# Altium schematic sheet CPU.SchDoc
size A3; SheetNumber: 2; SheetTotal: 7
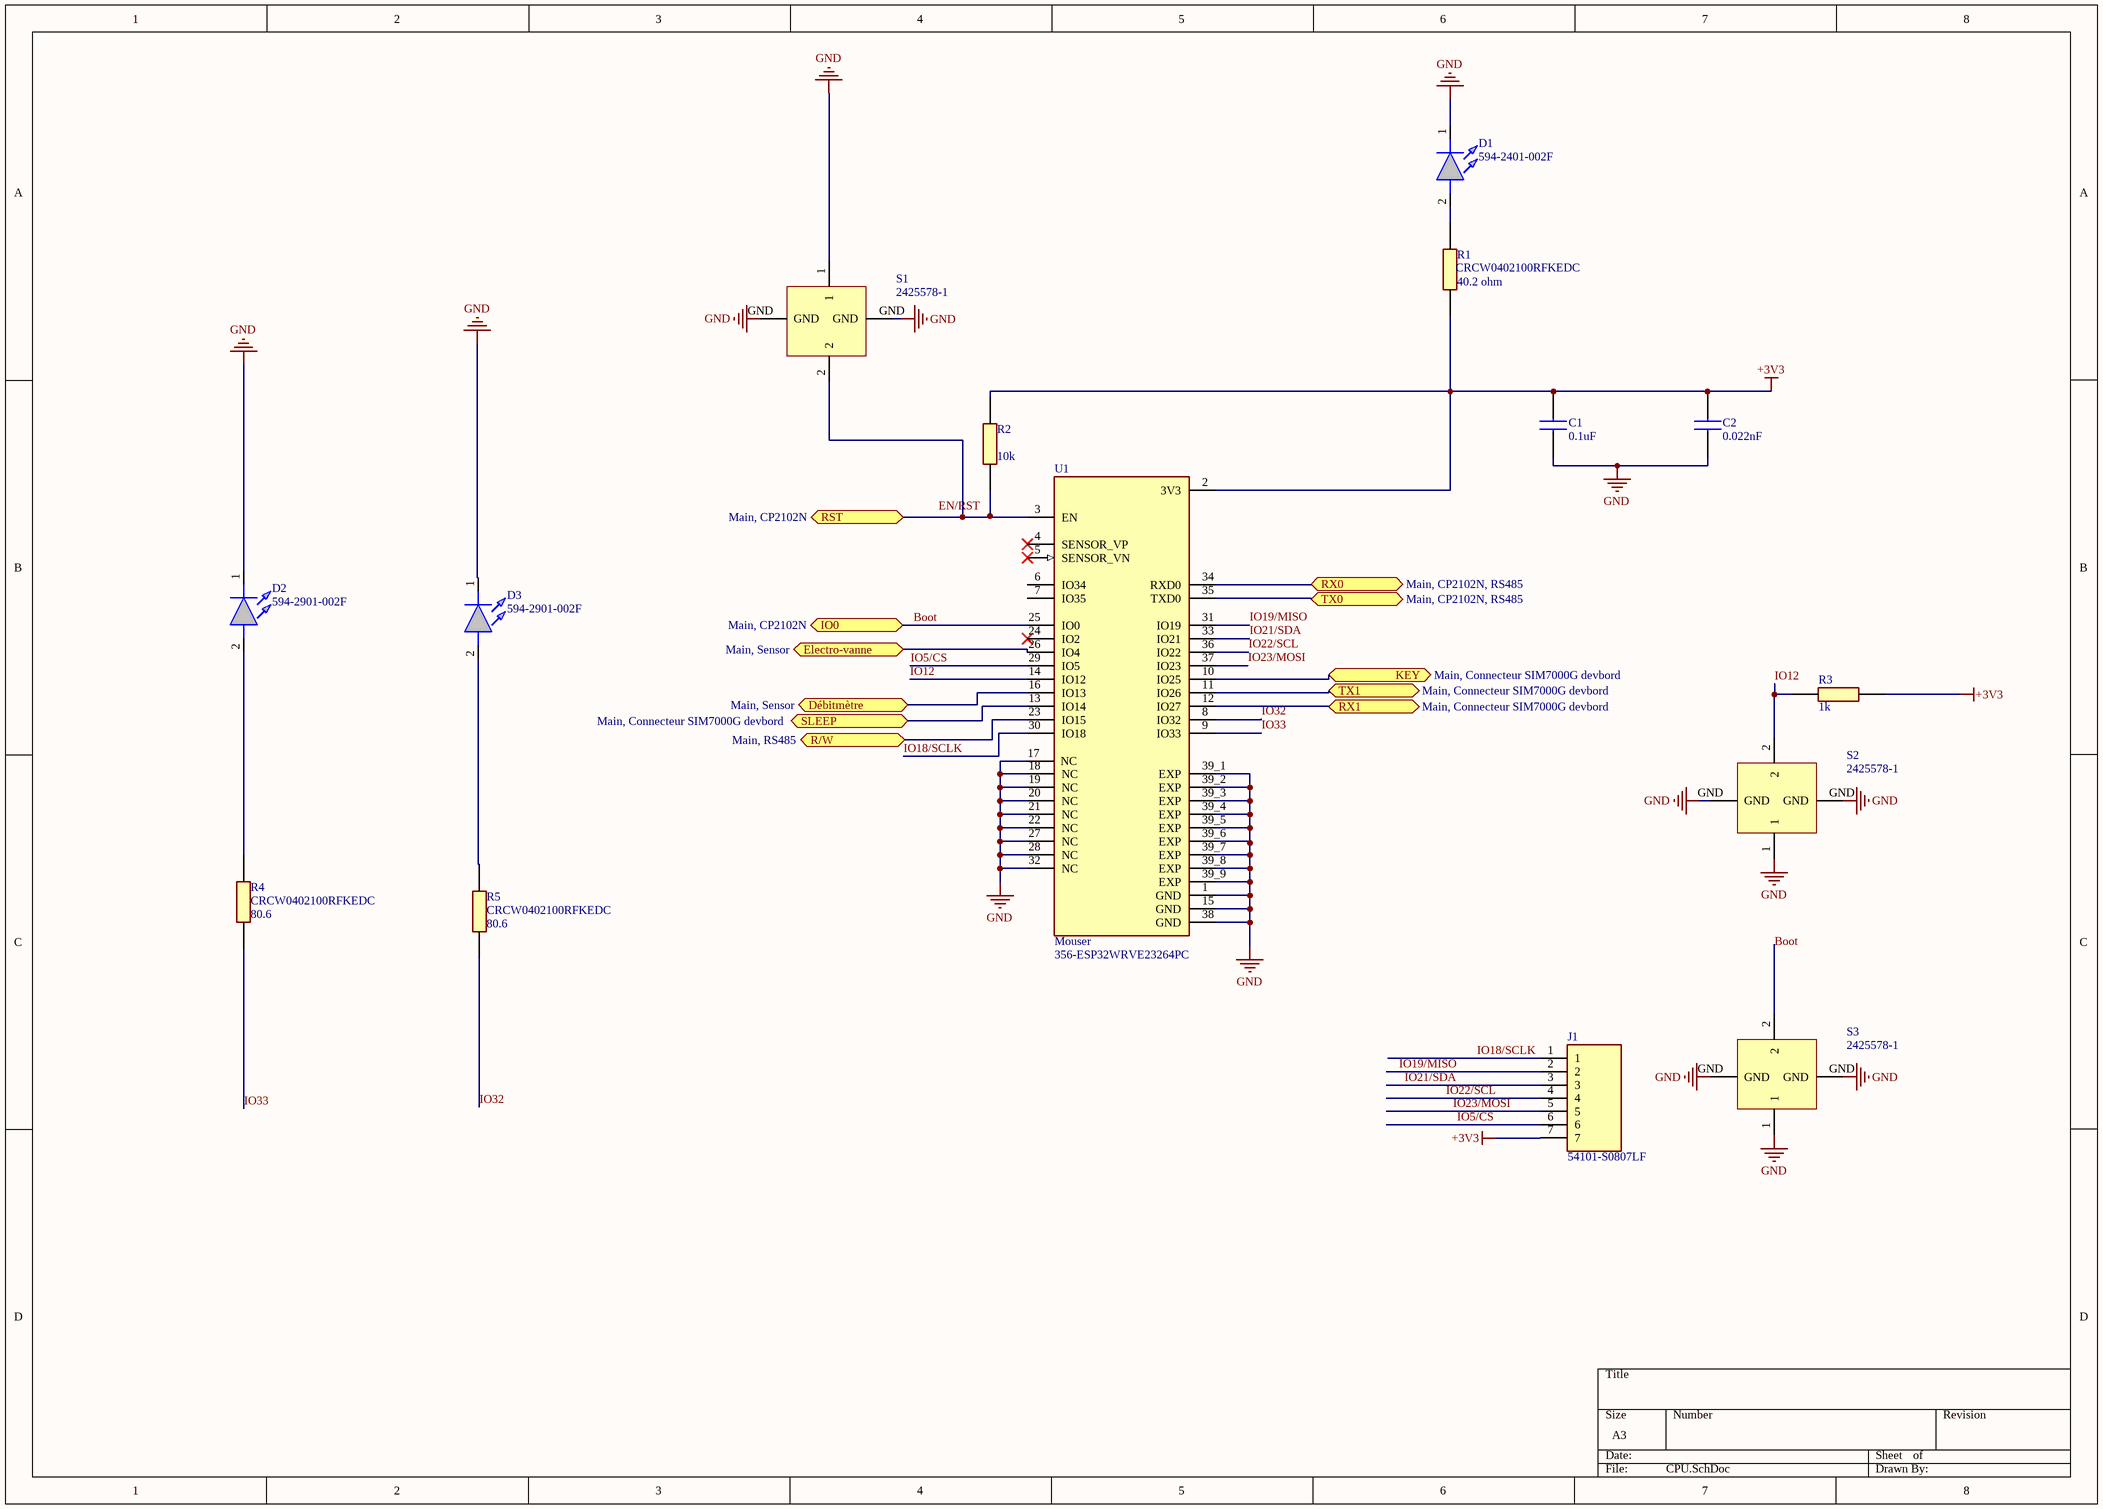
[diagram p0: CPU.SchDoc]

## Parts
C1  value 0.1uF  [CAPC1005X40N]  (hidden comment: 0402YD104KAT2A)
C2  value 0.022nF  [CAPC1005X40N]  (hidden comment: 0402ZD223KAT2A)
D1  594-2401-002F  [5942604013F]
D2  594-2901-002F  [5942604013F]
D3  594-2901-002F  [5942604013F]
J1  54101-S0807LF  [54101S0807LF]
R1  CRCW0402100RFKEDC  value 40.2 ohm  [RESC1005X40N]
R2  value 10k  [RESC1005X40N]  (hidden comment: RC0402FR-0710KL)
R3  value 1k  [RESC1005X40N]  (hidden comment: RT0402BRE071KL)
R4  CRCW0402100RFKEDC  value 80.6  [RESC1005X40N]
R5  CRCW0402100RFKEDC  value 80.6  [RESC1005X40N]
S1  2425578-1  [2425578-1]
S2  2425578-1  [2425578-1]
S3  2425578-1  [2425578-1]
U1  Supplier 1: Mouser  Supplier Part Number 1: 356-ESP32WRVE23264PC  [XCVR_ESP32-WROVER-E-N4R8]  (hidden comment: ESP32-WROVER-IE-N16R8)

## Ports
Débitmètre (bidir, see Main, Sensor), Electro-vanne (bidir, see Main, Sensor), IO0 (bidir, see Main, CP2102N), KEY (bidir, see Main, Connecteur SIM7000G devbord), R/W (bidir, see Main, RS485), RST (bidir, see Main, CP2102N), RX0 (bidir, see Main, CP2102N, RS485), RX1 (bidir, see Main, Connecteur SIM7000G devbord), SLEEP (bidir, see Main, Connecteur SIM7000G devbord), TX0 (bidir, see Main, CP2102N, RS485), TX1 (bidir, see Main, Connecteur SIM7000G devbord)

## Nets
+3V3: C1.2 C2.2 J1.7 R1.1 R2.2 R3.1 U1.2(3V3)
GND: C1.1 C2.1 D1.1(K) D2.1(K) D3.1(K) S1.1 S1.GND S2.1 S2.GND S3.1 S3.GND U1.1(GND) U1.15(GND) U1.17(NC) U1.18(NC) U1.19(NC) U1.20(NC) U1.21(NC) U1.22(NC) U1.27(NC) U1.28(NC) U1.32(NC) U1.38(GND) U1.39_1(EXP) U1.39_2(EXP) U1.39_3(EXP) U1.39_4(EXP) U1.39_5(EXP) U1.39_6(EXP) U1.39_7(EXP) U1.39_8(EXP) U1.39_9(EXP)
Boot: S3.2 U1.25(IO0) ; port IO0
Débitmètre: U1.16(IO13) ; port Débitmètre
Electro-vanne: U1.26(IO4) ; port Electro-vanne
IO5/CS: J1.6 U1.29(IO5)
IO12: R3.2 S2.2 U1.14(IO12)
IO18/SCLK: J1.1 U1.30(IO18)
IO19/MISO: J1.2 U1.31(IO19)
IO21/SDA: J1.3 U1.33(IO21)
IO22/SCL: J1.4 U1.36(IO22)
IO23/MOSI: J1.5 U1.37(IO23)
IO32: R5.1 U1.8(IO32)
IO33: R4.1 U1.9(IO33)
KEY: U1.10(IO25) ; port KEY
R/W: U1.23(IO15) ; port R/W
RST: R2.1 S1.2 U1.3(EN) ; port RST
RX0: U1.34(RXD0) ; port RX0
RX1: U1.12(IO27) ; port RX1
SLEEP: U1.13(IO14) ; port SLEEP
TX0: U1.35(TXD0) ; port TX0
TX1: U1.11(IO26) ; port TX1
NetD1_2: D1.2(A) R1.2
NetD2_2: D2.2(A) R4.2
NetD3_2: D3.2(A) R5.2

Not connected (* = marked no-connect by the designer): U1 4(SENSOR_VP)* 5(SENSOR_VN)* 6(IO34) 7(IO35) 24(IO2)*

## Notes on the sheet
- Labels drawn without touching a wire or pin: EN/RST

## Library data of the parts
C1 = 0402YD104KAT2A: Capacitor MLCC 0402 100nF 16V AVX 0402 Standard 100nF Ceramic Multilayer Capacitor, 16 V dc, +85C, X5R Dielectric, +/-10% SMD; Geometry.Height: 0.56mm; Mouser Part Number: 581-0402YD104K; Mouser Price/Stock: https://www.mouser.co.uk/ProductDetail/AVX/0402YD104KAT2A?qs=fS3i9m8Z%2FmrV7G1UZb6Y7g%3D%3D; Manufacturer_Name: AVX; Manufacturer_Part_Number: 0402YD104KAT2A; Datasheet Link: *; Supplier Part Number 1: 0402YD104KAT2A; Supplier 1: Avnet
C2 = 0402ZD223KAT2A: Multilayer Ceramic Capacitors MLCC - SMD/SMT 10V 0.022uF X5R 0402 10%; Manufacturer_Name: AVX; Manufacturer_Part_Number: 0402YD104KAT2A; Geometry.Height: 0.56mm; Mouser Part Number: 581-0402ZD223KAT2A; Mouser Price/Stock: https://www.mouser.co.uk/ProductDetail/AVX/0402YD104KAT2A?qs=fS3i9m8Z%2FmrV7G1UZb6Y7g%3D%3D; Datasheet Link: *; Supplier Part Number 1: 0402YD104KAT2A; Supplier 1: Avnet
D1-D3 = 594-2604-013F: LED Circuit Board Indicators 1.6mm IceBlue 2mA 13in reel; Manufacturer_Name: Dialight; Geometry.Height: 4.49mm; Mouser Part Number: 645-594-2604-013F; Mouser Price/Stock: https://www.mouser.co.uk/ProductDetail/Dialight/594-2604-013F?qs=GBLSl2AkiruyIh94PfnoyA%3D%3D; Manufacturer_Part_Number: 594-2604-013F; Datasheet Link: https://www.mouser.cn/datasheet/2/109/C18409B-1729493.pdf
J1 = 54101-S0807LF: BergStik, Board to Board connector, Unshrouded vertical Header, Through Hole, Single Row, 6 Positions, 2.54 mm Pitch.; Manufacturer_Name: Amphenol Communication Solutions; Geometry.Height: 8.58mm; Mouser Part Number: 649-54101-S0807LF; Mouser Price/Stock: https://www.mouser.co.uk/ProductDetail/Amphenol-FCI/54101-S0803LF?qs=iiM6sTJtPEc921tw16XaKg%3D%3D; Manufacturer_Part_Number: 54101-S0807LF; Datasheet Link: https://cdn.amphenol-cs.com/media/wysiwyg/files/drawing/54101.pdf
R1 = CRCW040240R2FKEDC: Résistances à couches épaisses - CMS 1/16watt 40.2ohms 1% Commercial Use; Manufacturer_Name: Vishay; Geometry.Height: 0.4mm; Mouser Part Number: 71-CRCW040240R2FKEDC; Mouser Price/Stock: https://www.mouser.co.uk/ProductDetail/Vishay-Dale/CRCW04024K70JNED?qs=iWCWVRvNViwY%252BotGHUbALg%3D%3D; Manufacturer_Part_Number: CRCW040240R2FKEDC; Datasheet Link: http://www.vishay.com/docs/20035/dcrcwe3.pdf; Supplier 1: Avnet; Supplier Part Number 1: 59M6737
R2 = RC0402FR-0710KL: Yageo 10k, 0402 (1005M) Thick Film SMD Resistor +/-1% 0.063W - RC0402FR-0710KL; Geometry.Height: 0.4mm; Mouser Part Number: 603-RC0402FR-0710KL; Mouser Price/Stock: https://www.mouser.co.uk/ProductDetail/YAGEO/RC0402FR-0710KL?qs=I1mnnYJTTsxUoNwrUsQExA%3D%3D; Manufacturer_Name: YAGEO; Manufacturer_Part_Number: RC0402FR-0710KL; Datasheet Link: https://componentsearchengine.com/Datasheets/2/RC0402FR-0710KL.pdf; Supplier Part Number 1: 7468275; Supplier 1: Future Electronics
R3 = RT0402BRE071KL: Thin Film Resistors - SMD 1/16W 1K ohm .1% 50ppm; Manufacturer_Name: YAGEO; Geometry.Height: 0.4mm; Mouser Part Number: 603-RT0402BRE071KL; Mouser Price/Stock: https://www.mouser.co.uk/ProductDetail/YAGEO/RC0402FR-0710KL?qs=I1mnnYJTTsxUoNwrUsQExA%3D%3D; Manufacturer_Part_Number: RT0402BRE071KL; Datasheet Link: https://componentsearchengine.com/Datasheets/2/RC0402FR-0710KL.pdf; Supplier 1: Future Electronics; Supplier Part Number 1: 3025706
R4 R5 = CRCW040280R6FKED: Résistances à couches épaisses - CMS 1/16watt 80.6ohms 1%; Manufacturer_Name: Vishay; Geometry.Height: 0.4mm; Mouser Part Number: 71-CRCW0402-80.6-E3; Mouser Price/Stock: https://www.mouser.co.uk/ProductDetail/Vishay-Dale/CRCW04024K70JNED?qs=iWCWVRvNViwY%252BotGHUbALg%3D%3D; Manufacturer_Part_Number: CRCW040280R6FKED; Datasheet Link: http://www.vishay.com/docs/20035/dcrcwe3.pdf; Supplier 1: Avnet; Supplier Part Number 1: 59M6737
S1-S3 = 2425578-1: Interrupteurs de contact Edge mount, right angle tactile, 160gf
U1 = ESP32-WROVER-E-N4R8: Bluetooth, WiFi 802.11b/g/n, Bluetooth v4.2 +EDR Transceiver Module 2.4GHz ~ 2.5GHz PCB Trace Surface Mount; MF: Espressif Systems; MP: ESP32WROVEREN4R8; SnapEDA_Link: https://www.snapeda.com/parts/ESP32WROVEREN4R8/Espressif+Systems/view-part/?ref=snap; Price: None; Check_prices: https://www.snapeda.com/parts/ESP32WROVEREN4R8/Espressif+Systems/view-part/?ref=eda; Value: *; Package: None; Availability: In Stock; Purchase-URL: https://pricing.snapeda.com/search/part/ESP32WROVEREN4R8/?ref=eda